# Altium schematic sheet Carrier_Power.SchDoc: Power
size A; Revision: A; SheetNumber: 11; SheetTotal: 12; ECE315_Project_Name: ECE453 F25 Staff Dev Board
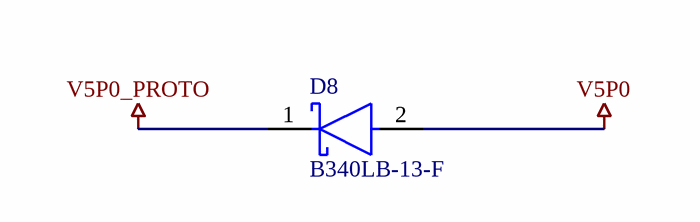
[diagram p0: Carrier_Power.SchDoc]

## Parts
D8  B340LB-13-F  [FP-SMB-MFG]

## Nets
V5P0: D8.2(A)
V5P0_PROTO: D8.1(C)

## Notes on the sheet
- Title:
- Size:
- A
- Project
- Rev:
- Sheet:
- of
- College of Engineering
- 1415 Engineering Drive
- Madison, WI 53706

## Library data of the parts
D8 = CMP-12790-000022-1: DIODE SCHOTTKY 40V 3A SMB; Manufacturer: Diodes Inc.; Max Surge Forward Current: 70A; Value: 180pF; Peak Reverse Current: 2mA; Standoff Height: 0.05mm; Max Junction Temp: +150°C; Device Class L2: Diodes; Octopart: https://octopart.com/b340lb-13-f-diodes+inc.-325823; Device Class L1: Discrete Semiconductors; Forward Current: 3A; Automotive: No; Manufacturer Part Number: B340LB-13-F; Temperature: -55°C to +150°C; Temperature Range Low: -55°C; Max Repetitive Reverse Voltage: 40V; Device Class L3: Schottky Diodes; RoHS: TRUE; Height: 2.5mm; ComponentLink2URL: https://www.diodes.com/assets/Datasheets/ds30240.pdf; Package: SMB; Digikey Description: DIODE SCHOTTKY 40V 3A SMB; Lead Free: Yes; Category: Diode; Reverse Voltage: 40V; Mouser Description: Schottky Diodes & Rectifiers 40V 3A; ComponentLink2Description: Datasheet; Footprint Url: https://www.diodes.com/assets/Package-Files/SMB.pdf; Temperature Range High: +150°C; Capacitance: 180pF